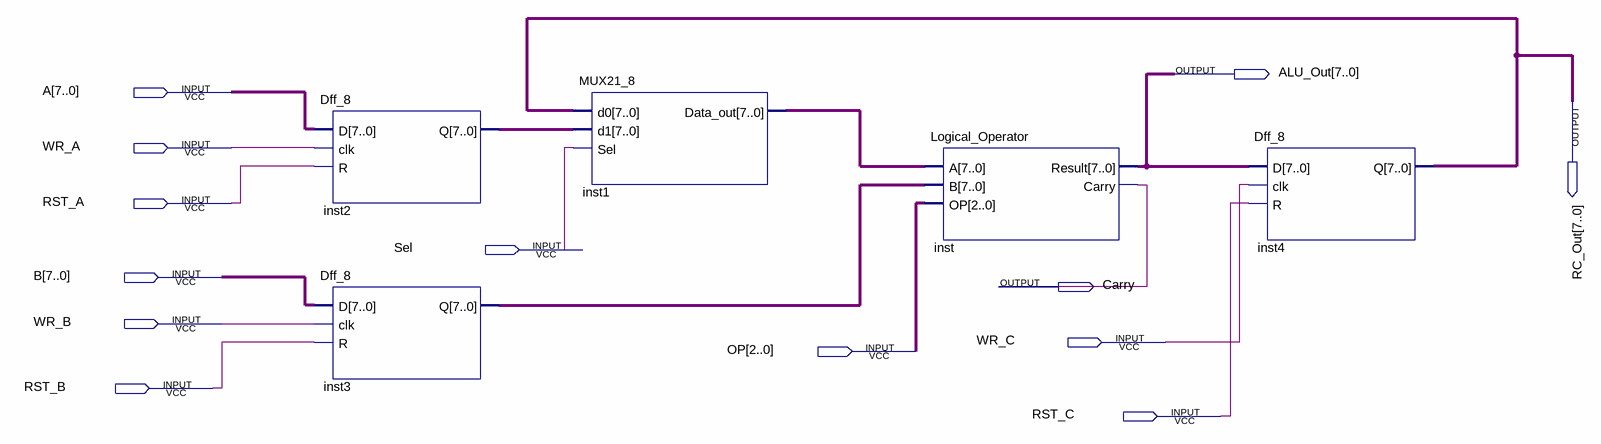
[diagram p0: schematic sheet]
// Quartus schematic Project_ALU.bdf as structural Verilog: 5 symbols, 13 pins
module Project_ALU (
  input  [7:0] A,
  input  WR_A,
  input  RST_A,
  input  Sel,
  input  [7:0] B,
  input  WR_B,
  input  WR_C,
  input  [2:0] OP,
  input  RST_B,
  input  RST_C,
  output [7:0] ALU_Out,
  output [7:0] RC_Out,
  output Carry
);

  wire [7:0] inst1_data_out, inst2_q, inst3_q;

  Dff_8 inst2 (.D(A), .clk(WR_A), .R(RST_A), .Q(inst2_q));
  Dff_8 inst3 (.D(B), .clk(WR_B), .R(RST_B), .Q(inst3_q));
  MUX21_8 inst1 (.d0(RC_Out), .d1(inst2_q), .Sel(Sel), .Data_out(inst1_data_out));
  Logical_Operator inst (.A(inst1_data_out), .B(inst3_q), .OP(OP), .Result(ALU_Out), .Carry(Carry));
  Dff_8 inst4 (.D(ALU_Out), .clk(WR_C), .R(RST_C), .Q(RC_Out));
endmodule
